# EAGLE design arduino_shield_drumline (EAGLE 7.7.0)
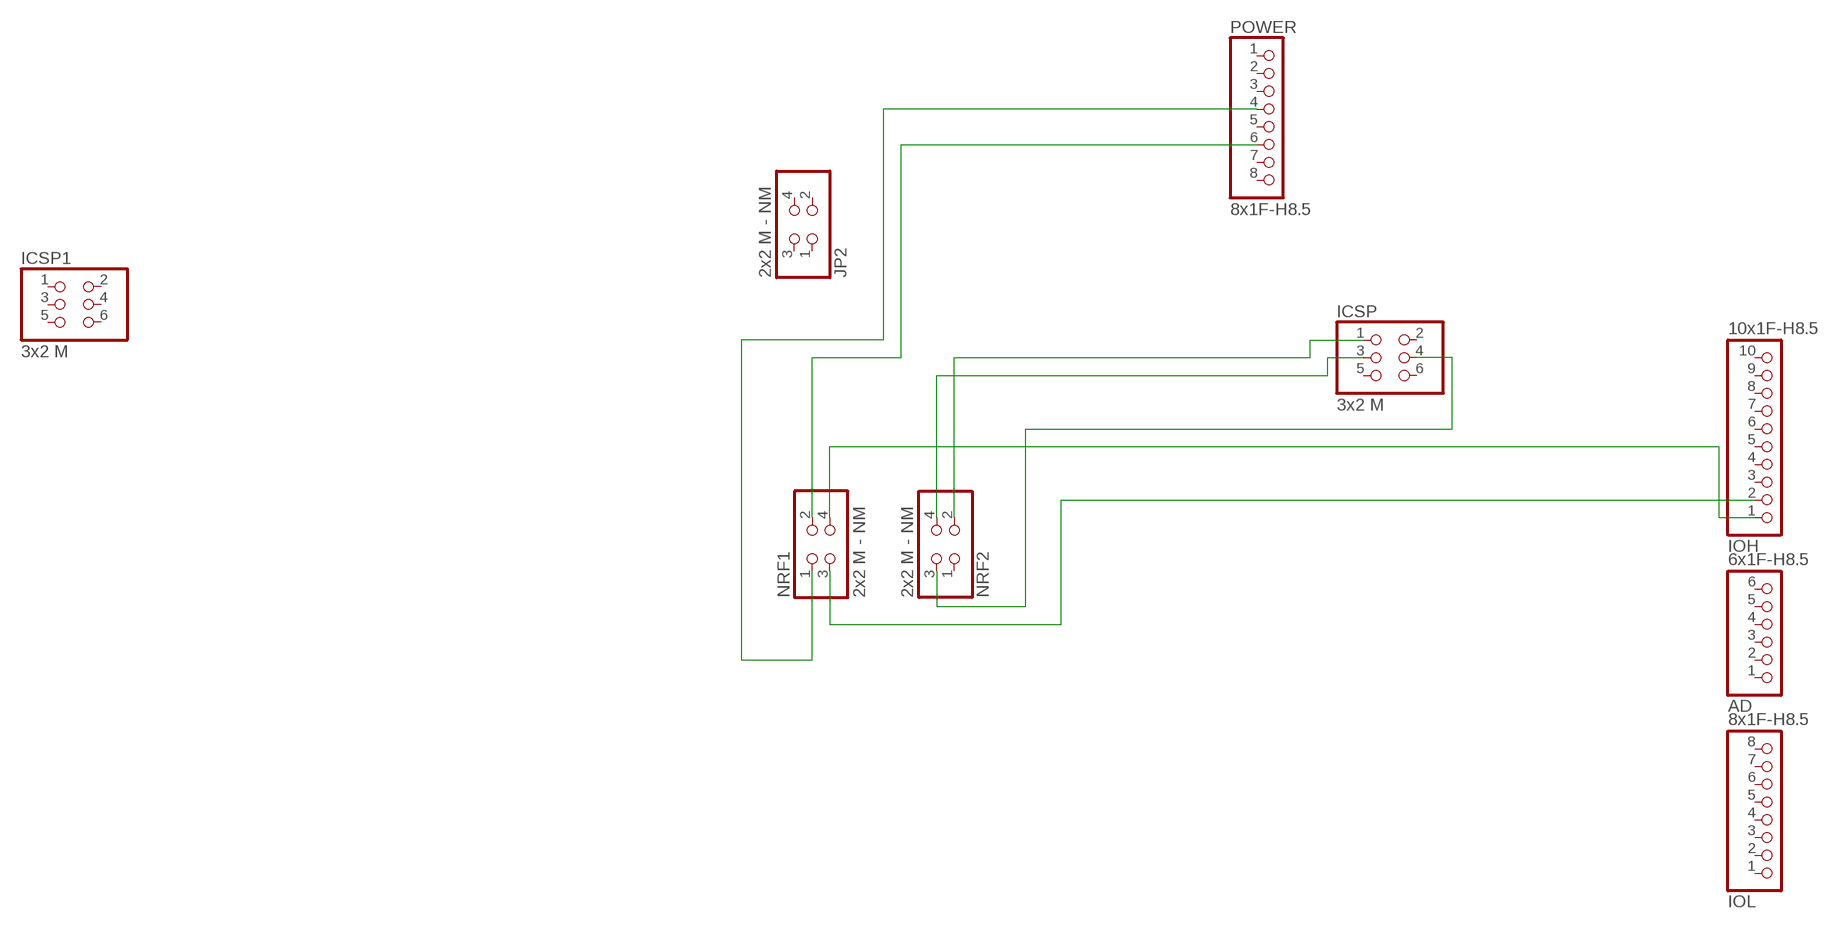
[diagram p0: schematic, sheet 1]

## Parts
AD  6x1F-H8.5  PINHD-1X6  [1X06]
ICSP  3x2 M  PINHD-2X3  [2X03]
ICSP1  3x2 M  PINHD-2X3  [2X03]
IOH  10x1F-H8.5  PINHD-1X10_ARD  [1X10]
IOL  8x1F-H8.5  PINHD-1X8  [1X08]
JP2  2x2 M - NM  PINHD-2X2  [2X02]
NRF1  2x2 M - NM  PINHD-2X2  [2X02]
NRF2  2x2 M - NM  PINHD-2X2  [2X02]
POWER  8x1F-H8.5  PINHD-1X8  [1X08]

## Nets
N$1: NRF1.1 POWER.4
N$2: NRF1.2 POWER.6
N$3: IOH.1 NRF1.4
N$4: IOH.2 NRF1.3
N$5: ICSP.3 NRF2.4
N$6: ICSP.1 NRF2.2
N$7: ICSP.4 NRF2.3
Unconnected: AD.1 AD.2 AD.3 AD.4 AD.5 AD.6 ICSP1.1 ICSP1.2 ICSP1.3 ICSP1.4 ICSP1.5 ICSP1.6 ICSP.2 ICSP.5 ICSP.6 IOH.3 IOH.4 IOH.5 IOH.6 IOH.7 IOH.8 IOH.9 IOH.10 IOL.1 IOL.2 IOL.3 IOL.4 IOL.5 IOL.6 IOL.7 IOL.8 JP2.1 JP2.2 JP2.3 JP2.4 NRF2.1 POWER.1 POWER.2 POWER.3 POWER.5 POWER.7 POWER.8

## Library data of the parts
AD = SmartPrj:PINHD-1X6: PIN HEADER
ICSP ICSP1 = SmartPrj:PINHD-2X3: PIN HEADER
IOH = SmartPrj:PINHD-1X10_ARD: PIN HEADER
IOL POWER = SmartPrj:PINHD-1X8: PIN HEADER
JP2 NRF1 NRF2 = SmartPrj:PINHD-2X2: PIN HEADER

## Net classes
0 default: width 0.254 mm, clearance 0.254 mm
1 power: width 0.61 mm, drill 0.61 mm, clearance 0.254 mm
2 gnd: width 0.305 mm, drill 0.559 mm, clearance 0.254 mm
3 usbvcc: width 0.508 mm, drill 0.61 mm, clearance 0.254 mm
4 aref: width 0.406 mm, drill 0.61 mm, clearance 0.254 mm

## Board
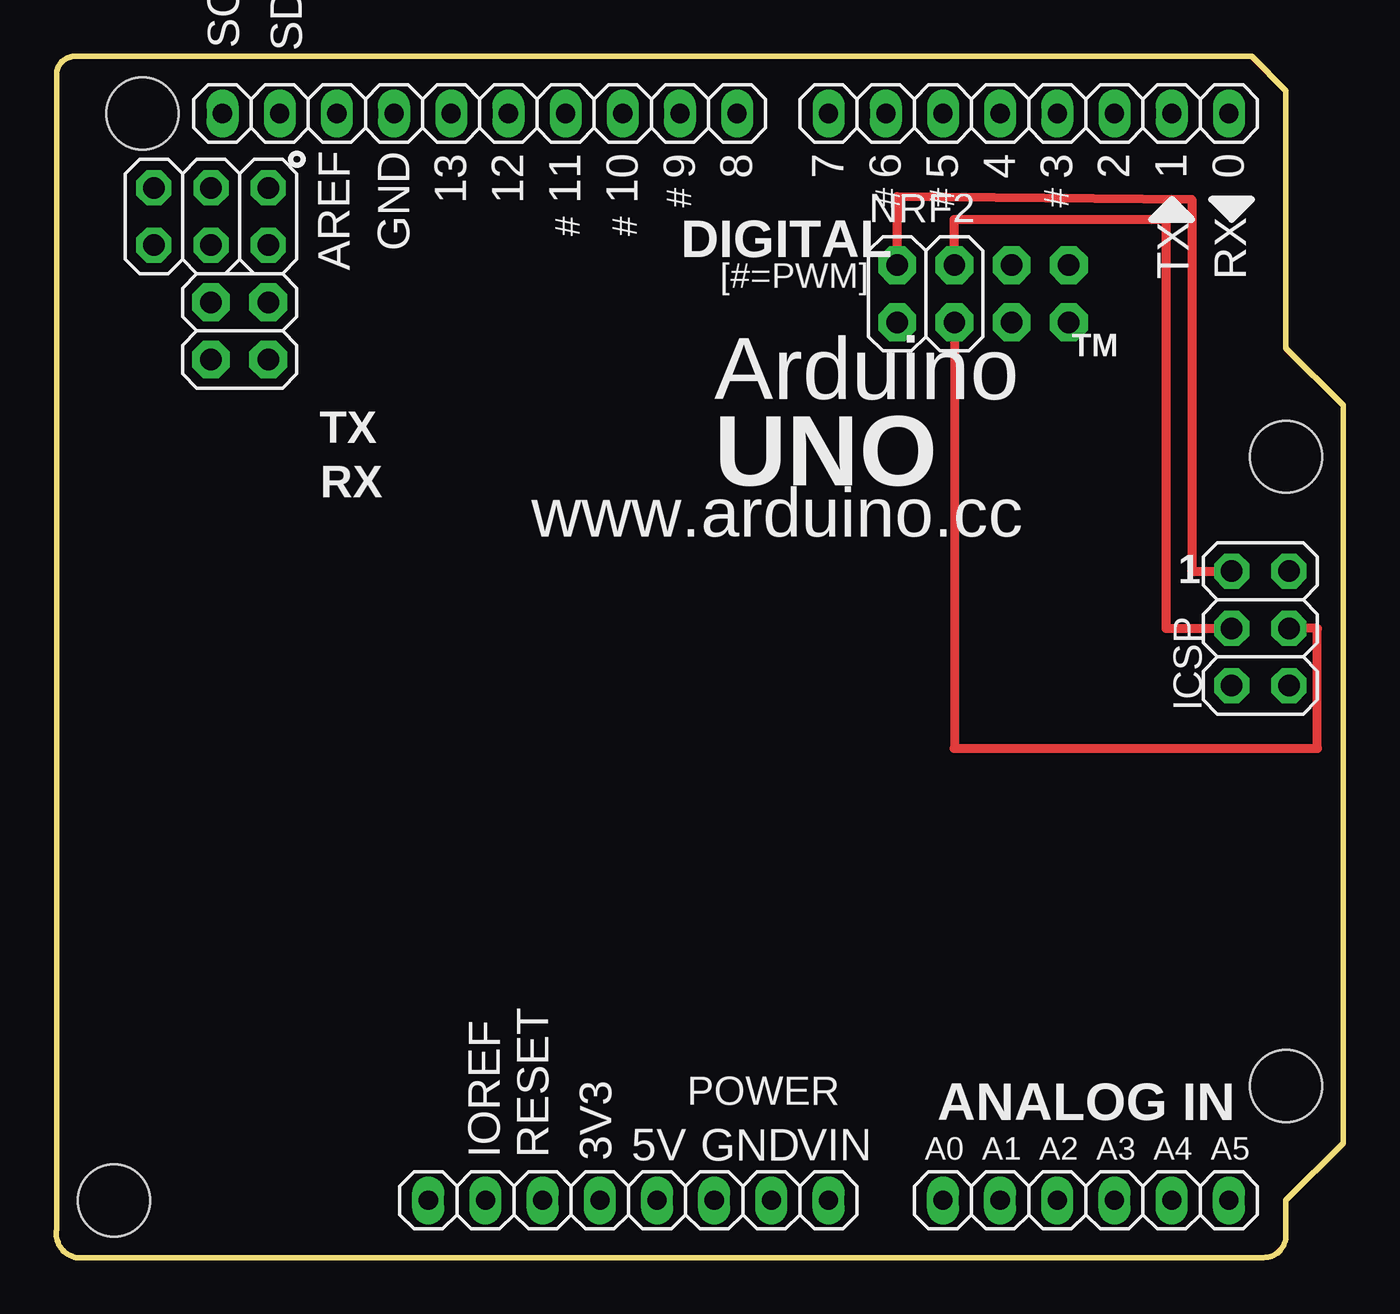
[diagram p1: board, top side]
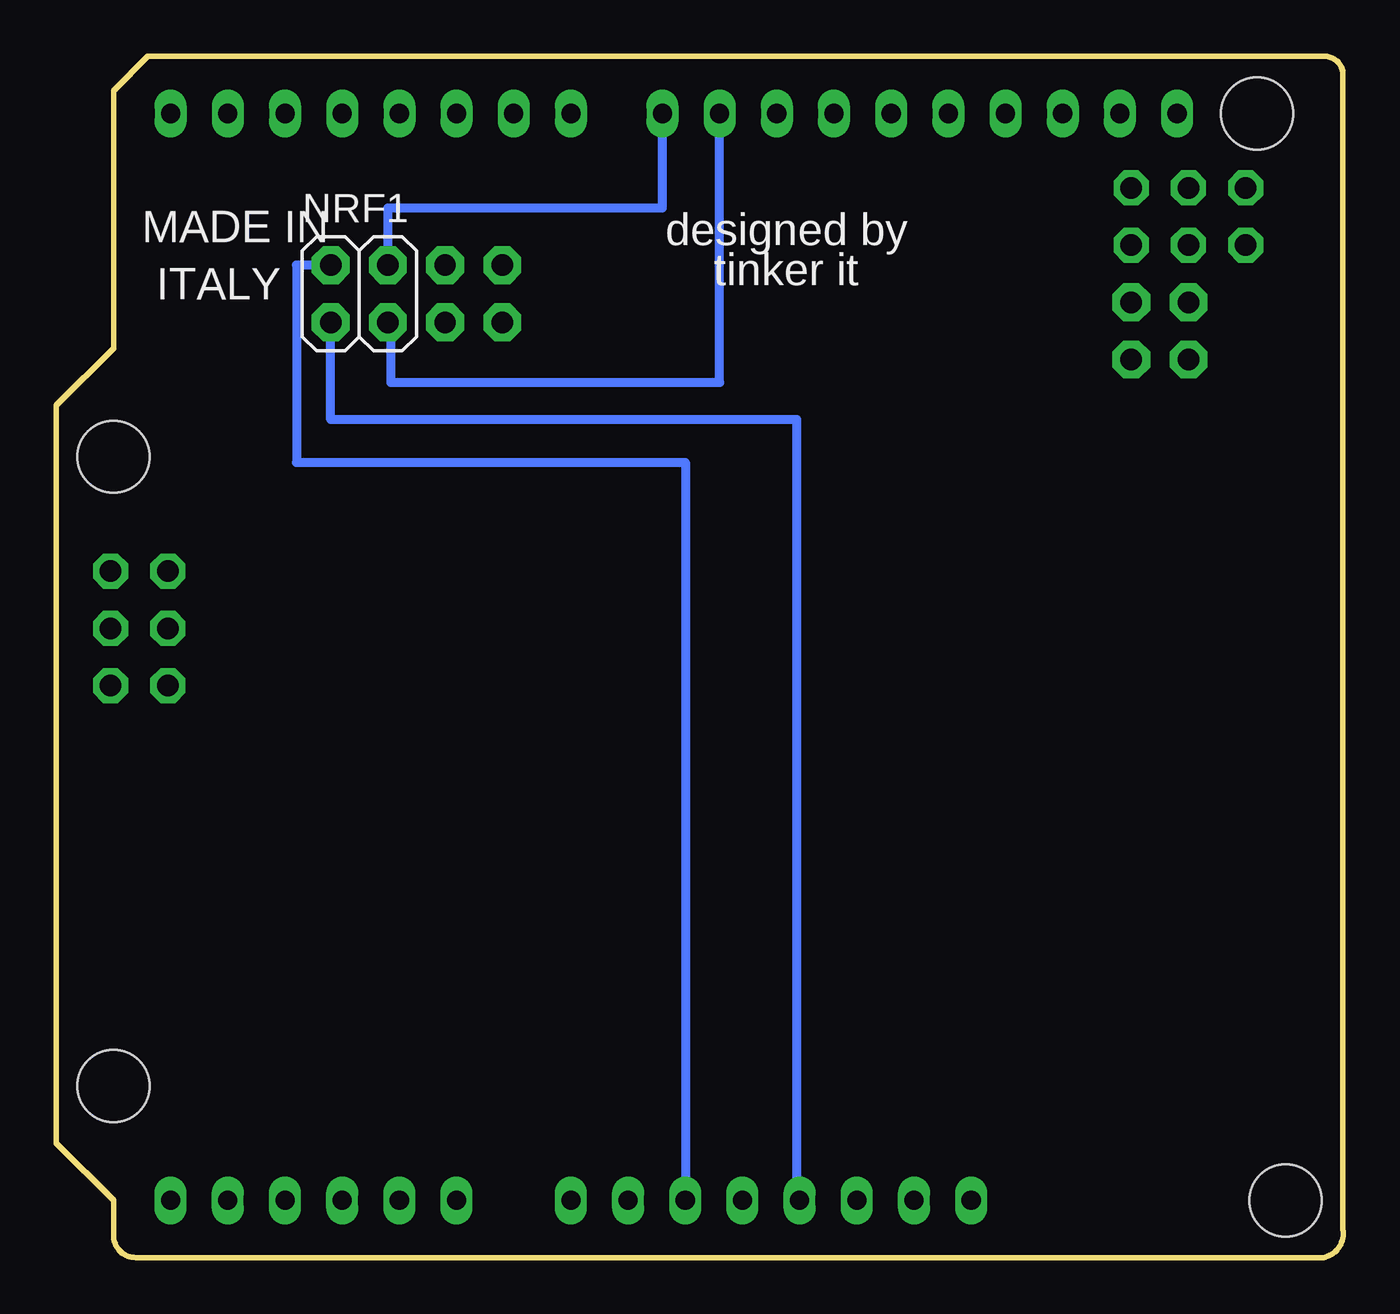
[diagram p2: board, bottom side, seen from below]

Size 57.17 x 53.34 mm. Coordinates in mm from the lower left corner, seen from the top.
Outline: 53.1,53.34 54.63,51.82 54.63,40.39 57.17,37.85 57.17,5.08 54.63,2.54 54.63,1 arc-90 53.63,0 0.89,0 arc-90 0.02,1.25 0.02,52.59 arc-90 0.89,53.34 53.1,53.34
Copper layers (1*16): Top 0.035mm / dielectric 1.5mm / Bottom 0.035mm
Design rules "default": minimum track width 10mil, minimum drill 22mil, track to track 10mil, track to pad 10mil, pad to pad 10mil, via to via 12mil, smd to smd 8mil, copper to edge 26mil, drill to drill 12mil, minimum pad ring 10mil, minimum via ring 10mil, stop-mask expansion 1mil, vias tented up to drill 30mil, thermal gap 10mil
Holes 3.2 mm at 54.63,35.56 54.63,7.62 3.83,50.8 2.56,2.54
vRestrict: area 11.4,44.1 to 13.2,49.1; area 14,45.5 to 15.6,49.1; area 17,45.3 to 18.2,48.8; area 19.6,45.3 to 20.7,48.8; area 22.1,45.3 to 23.3,48.8; area 24.7,45.3 to 25.8,48.8; area 27.3,47.2 to 28.5,48.8; area 28.8,45.1 to 36.2,46.9; area 48.9,44.2 to 50.3,46.7; area 51.5,44.2 to 52.8,46.7; area 49.9,35.8 to 53.4,37.2; area -10.8,21.8 to -9.4,30.1; 14 more areas

### Footprints (pad centres in the part's own frame; a part is rotated, then mirrored left to right if it is on the bottom)
1X06 = drill 0.85 pad 1.422 long: 1 -6.35,0; 2 -3.81,0; 3 -1.27,0; 4 1.27,0; 5 3.81,0; 6 6.35,0
2X03 = drill 0.95 pad 1.55 octagon: 1 -2.54,-1.27; 2 -2.54,1.27; 3 0,-1.27; 4 0,1.27; 5 2.54,-1.27; 6 2.54,1.27
1X10 = drill 0.85 pad 1.422 long: 1 -11.43,0; 2 -8.89,0; 3 -6.35,0; 4 -3.81,0; 5 -1.27,0; 6 1.27,0; 7 3.81,0; 8 6.35,0; 9 8.89,0; 10 11.43,0
1X08 = drill 0.85 pad 1.422 long: 1 -8.89,0; 2 -6.35,0; 3 -3.81,0; 4 -1.27,0; 5 1.27,0; 6 3.81,0; 7 6.35,0; 8 8.89,0
2X02 = drill 0.95 pad 1.676 octagon: 1 -1.27,-1.27; 2 -1.27,1.27; 3 1.27,-1.27; 4 1.27,1.27

### Placement (x,y rotation side)
AD  45.74,2.54 0 top
ICSP  53.48,27.94 270 top
ICSP1  6.87,46.23 180 top
IOH  18.81,50.8 180 top
IOL  43.2,50.8 180 top
JP2  8.14,41.15 90 top
NRF1  43.7,42.8 0 bottom
NRF2  38.62,42.8 0 top
POWER  25.42,2.54 0 top

### Tracks (layer width: path | path; a pad name or v marks a point on that pad's centre or on a via)
N$1
  Bottom 0.406: POWER.4 24.27,2.54 24.27,37.21 44.97,37.21 NRF1.1
N$2
  Bottom 0.406: NRF1.2 46.5,44.07 46.5,35.31 29.23,35.31 POWER.6
N$3
  Bottom 0.406: NRF1.4 42.43,46.61 30.24,46.61 IOH.1
N$4
  Bottom 0.406: NRF1.3 42.31,41.53 42.31,38.86 27.7,38.86 IOH.2
N$5
  Top 0.406: NRF2.4 39.89,46.1 49.29,46.1 49.29,27.94 ICSP.3
N$6
  Top 0.406: NRF2.2 37.35,47.12 50.44,46.99 50.44,30.48 ICSP.1
N$7
  Top 0.406: NRF2.3 39.89,22.61 56.02,22.61 56.02,27.94 ICSP.4

### Text on the board
tPlace: 13 | 12 | 11 | 10 | 9 | 8 | 7 | 6 | 5 | 4 | 3 | 2 | 1 | 0
tNames: SCL | SDA | M.Banzi | D.Cuartielles | T.Igoe | AREF | GND | G.Martino | # | # | # | # | D.Mellis | # | # | DIGITAL | [#=PWM] | TX | RX | TM | TX | Arduino | RX | UNO | www.arduino.cc | 1 | ANALOG IN | IOREF | RESET | 3V3 | 5V | GND | VIN | A0 | A1 | A2 | A3 | A4 | A5
bNames: MADE IN | designed by | MADE IN | ITALY | tinker it | ITALY | designed by | tinker it | ATMEGA328
ReferenceLC: L | TX | ON | RX | PC1 | PC2
214bmp: D:/SmartProjects/Snc/a4_bn_logo2.bmp